# EAGLE design ESP32 AC dimmer 10ch r1 (EAGLE 9.0.0)
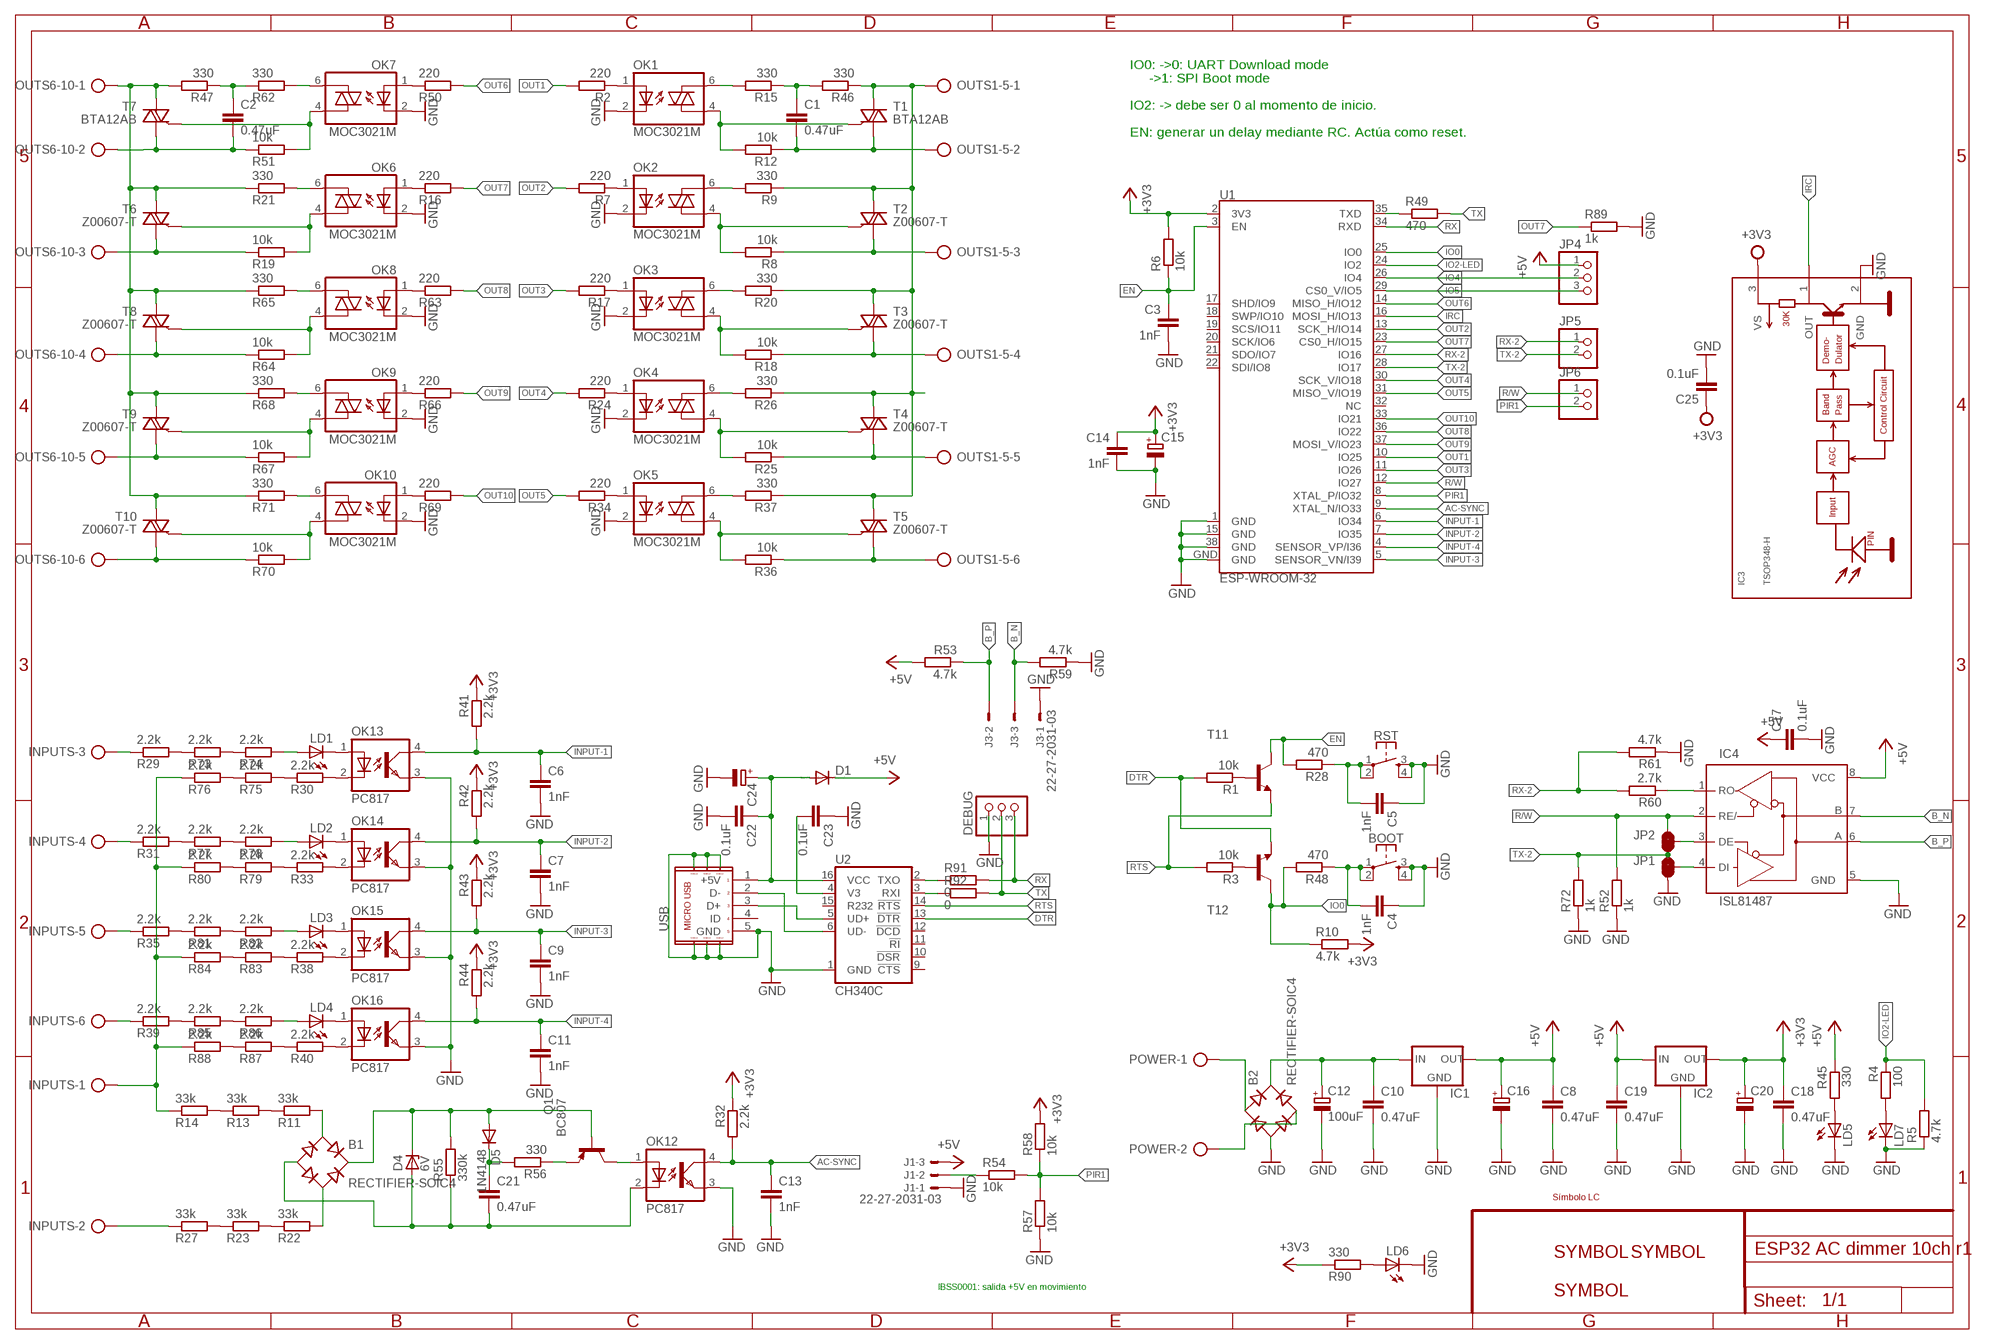
[diagram p0: schematic, sheet 1]

## Parts
B1  RECTIFIER-SOIC4  [SOIC4]
B2  RECTIFIER-SOIC4  [SOIC4]
BOOT  MOMENTARY-SWITCH-SPST-2-SMD-4.6X2.8MM  [TACTILE_SWITCH_SMD_4.6X2.8MM]
C1  0.47uF  C-EU075-042X103  [C075-042X103]
C2  0.47uF  C-EU075-042X103  [C075-042X103]
C3  1nF  C-EUC0603  [C0603]
C4  1nF  C-EUC0603  [C0603]
C5  1nF  C-EUC0603  [C0603]
C6  1nF  C-EUC0603  [C0603]
C7  1nF  C-EUC0603  [C0603]
C8  0.47uF  C-EUC0805  [C0805]
C9  1nF  C-EUC0603  [C0603]
C10  0.47uF  C-EUC0805  [C0805]
C11  1nF  C-EUC0603  [C0603]
C12  100uF  CPOL-EUE3.5-8  [E3,5-8]
C13  1nF  C-EUC0603  [C0603]
C14  1nF  C-EUC0805  [C0805]
C15  CPOL-EUSMCA  [SMC_A]
C16  CPOL-EUSMCA  [SMC_A]
C17  0.1uF  RCL_C-EUC0603  [RCL_C0603]
C18  0.47uF  C-EUC0805  [C0805]
C19  0.47uF  C-EUC0805  [C0805]
C20  CPOL-EUSMCA  [SMC_A]
C21  0.47uF  C-EUC0805  [C0805]
C22  0.1uF  C-EUC0603  [C0603]
C23  0.1uF  C-EUC0603  [C0603]
C24  CPOL-EUSMCA  [SMC_A]
C25  0.1uF  C-EUC0603  [C0603]
D1  DIODE-SOD323-R  [SOD323-R]
D4  6V  ZENER-DIODESOD80C  [SOD80C]
D5  1N4148  DIODE-MINIMELF  [MINIMELF]
DEBUG  PINHD-1X3  [1X03]
IC1  LM1117  [SOT223]
IC2  LM1117  [SOT223]
IC3  TSOP348-H  [TSOP348H]
IC4  ISL81487  MAXIM_MAX3468CSA  [MAXIM_SO08]
INPUTS  AK500/6  [AK500/6]
J1  22-27-2031-03  [6410-03]
J3  22-27-2031-03  [6410-03]
JP1  JUMPER-SMT_3_1-NC_TRACE_SILK  [SMT-JUMPER_3_1-NC_TRACE_SILK]
JP2  JUMPER-SMT_3_1-NC_TRACE_SILK  [SMT-JUMPER_3_1-NC_TRACE_SILK]
JP4  PINHD-1X3  [1X03]
JP5  PINHD-1X2  [1X02]
JP6  PINHD-1X2  [1X02]
LD1  LEDCHIPLED_0805  [CHIPLED_0805]
LD2  LEDCHIPLED_0805  [CHIPLED_0805]
LD3  LEDCHIPLED_0805  [CHIPLED_0805]
LD4  LEDCHIPLED_0805  [CHIPLED_0805]
LD5  LEDCHIPLED_0805  [CHIPLED_0805]
LD6  LEDCHIPLED_0805  [CHIPLED_0805]
LD7  LEDCHIPLED_0805  [CHIPLED_0805]
OK1  MOC3021M  [DIL06]
OK2  MOC3021M  [DIL06]
OK3  MOC3021M  [DIL06]
OK4  MOC3021M  [DIL06]
OK5  MOC3021M  [DIL06]
OK6  MOC3021M  [DIL06]
OK7  MOC3021M  [DIL06]
OK8  MOC3021M  [DIL06]
OK9  MOC3021M  [DIL06]
OK10  MOC3021M  [DIL06]
OK12  PC817  [DIL04]
OK13  PC817  [DIL04]
OK14  PC817  [DIL04]
OK15  PC817  [DIL04]
OK16  PC817  [DIL04]
OUTS1-5  AK500/6  [AK500/6]
OUTS6-10  AK500/6  [AK500/6]
POWER  AK500/2  [AK500/2]
Q1  BC807  BC807-25-PNP-SOT23-BEC  [SOT23-BEC]
R1  10k  R-EU_R0603  [R0603]
R2  220  R-EU_R0603  [R0603]
R3  10k  R-EU_R0603  [R0603]
R4  100  R-EU_R0603  [R0603]
R5  4.7k  R-EU_R0603  [R0603]
R6  10k  R-EU_R0603  [R0603]
R7  220  R-EU_R0603  [R0603]
R8  10k  R-EU_0204/5  [0204/5]
R9  330  R-EU_0204/5  [0204/5]
R10  4.7k  R-EU_R0603  [R0603]
R11  33k  R-EU_R0805  [R0805]
R12  10k  R-EU_0204/5  [0204/5]
R13  33k  R-EU_R0805  [R0805]
R14  33k  R-EU_R0805  [R0805]
R15  330  R-EU_0204/5  [0204/5]
R16  220  R-EU_R0603  [R0603]
R17  220  R-EU_R0603  [R0603]
R18  10k  R-EU_0204/5  [0204/5]
R19  10k  R-EU_0204/5  [0204/5]
R20  330  R-EU_0204/5  [0204/5]
R21  330  R-EU_0204/5  [0204/5]
R22  33k  R-EU_R0805  [R0805]
R23  33k  R-EU_R0805  [R0805]
R24  220  R-EU_R0603  [R0603]
R25  10k  R-EU_0204/5  [0204/5]
R26  330  R-EU_0204/5  [0204/5]
R27  33k  R-EU_R0805  [R0805]
R28  470  R-EU_R0603  [R0603]
R29  2.2k  R-EU_R0805  [R0805]
R30  2.2k  R-EU_R0805  [R0805]
R31  2.2k  R-EU_R0805  [R0805]
R32  2.2k  R-EU_R0603  [R0603]
R33  2.2k  R-EU_R0805  [R0805]
R34  220  R-EU_R0603  [R0603]
R35  2.2k  R-EU_R0805  [R0805]
R36  10k  R-EU_0204/5  [0204/5]
R37  330  R-EU_0204/5  [0204/5]
R38  2.2k  R-EU_R0805  [R0805]
R39  2.2k  R-EU_R0805  [R0805]
R40  2.2k  R-EU_R0805  [R0805]
R41  2.2k  R-EU_R0603  [R0603]
R42  2.2k  R-EU_R0603  [R0603]
R43  2.2k  R-EU_R0603  [R0603]
R44  2.2k  R-EU_R0603  [R0603]
R45  330  R-EU_R0603  [R0603]
R46  330  R-EU_0204/7  [0204/7]
R47  330  R-EU_0204/7  [0204/7]
R48  470  R-EU_R0603  [R0603]
R49  470  R-EU_R0603  [R0603]
R50  220  R-EU_R0603  [R0603]
R51  10k  R-EU_0204/5  [0204/5]
R52  1k  R-EU_R0603  [R0603]
R53  4.7k  R-EU_R0603  [R0603]
R54  10k  R-EU_R0603  [R0603]
R55  330k  R-EU_R0805  [R0805]
R56  330  R-EU_R0805  [R0805]
R57  10k  R-EU_R0603  [R0603]
R58  10k  R-EU_R0603  [R0603]
R59  4.7k  R-EU_R0603  [R0603]
R60  2.7k  R-EU_R0603  [R0603]
R61  4.7k  R-EU_R0603  [R0603]
R62  330  R-EU_0204/5  [0204/5]
R63  220  R-EU_R0603  [R0603]
R64  10k  R-EU_0204/5  [0204/5]
R65  330  R-EU_0204/5  [0204/5]
R66  220  R-EU_R0603  [R0603]
R67  10k  R-EU_0204/5  [0204/5]
R68  330  R-EU_0204/5  [0204/5]
R69  220  R-EU_R0603  [R0603]
R70  10k  R-EU_0204/5  [0204/5]
R71  330  R-EU_0204/5  [0204/5]
R72  1k  R-EU_R0603  [R0603]
R73  2.2k  R-EU_R0805  [R0805]
R74  2.2k  R-EU_R0805  [R0805]
R75  2.2k  R-EU_R0805  [R0805]
R76  2.2k  R-EU_R0805  [R0805]
R77  2.2k  R-EU_R0805  [R0805]
R78  2.2k  R-EU_R0805  [R0805]
R79  2.2k  R-EU_R0805  [R0805]
R80  2.2k  R-EU_R0805  [R0805]
R81  2.2k  R-EU_R0805  [R0805]
R82  2.2k  R-EU_R0805  [R0805]
R83  2.2k  R-EU_R0805  [R0805]
R84  2.2k  R-EU_R0805  [R0805]
R85  2.2k  R-EU_R0805  [R0805]
R86  2.2k  R-EU_R0805  [R0805]
R87  2.2k  R-EU_R0805  [R0805]
R88  2.2k  R-EU_R0805  [R0805]
R89  1k  R-EU_R0603  [R0603]
R90  330  R-EU_R0603  [R0603]
R91  0  R-EU_R0603  [R0603]
R92  0  R-EU_R0603  [R0603]
RST  MOMENTARY-SWITCH-SPST-2-SMD-4.6X2.8MM  [TACTILE_SWITCH_SMD_4.6X2.8MM]
SYM1  LC-3.81  [LC_3.81MM]
T1  BTA12AB  [TO220DS]
T2  Z00607-T  [TO92-A1GA2]
T3  Z00607-T  [TO92-A1GA2]
T4  Z00607-T  [TO92-A1GA2]
T5  Z00607-T  [TO92-A1GA2]
T6  Z00607-T  [TO92-A1GA2]
T7  BTA12AB  [TO220DS]
T8  Z00607-T  [TO92-A1GA2]
T9  Z00607-T  [TO92-A1GA2]
T10  Z00607-T  [TO92-A1GA2]
T11  BC817-16-NPN-SOT23-BEC  [SOT23-BEC]
T12  BC817-16-NPN-SOT23-BEC  [SOT23-BEC]
U1  ESP-WROOM-32  [ESP-WROOM-32]
U2  CH340C  [SO016]
U$1  SYMBOLS  [WIFI_SYM]
U$2  SYMBOLS  [WIFI_SYM]
U$3  SYMBOLS-1  [WIFI-SYM2]
USB  MICROUSB-LP  [MICROUSB-4PIN-LONGPIN]

## Nets
+3V3: C14.1 C15.+ C18.1 C20.+ C25.1 IC2.2(OUT) IC3.3(VS) R6.2 R10.2 R32.1 R41.1 R42.1 R43.1 R44.1 R58.2 R90.1 U1.2(3V3)
+5V: C8.1 C16.+ C17.1 C19.1 D1.C IC1.2(OUT) IC2.3(IN) IC4.8(VCC) J1.3 JP4.1 R45.1 R53.2 ; supply symbol labelled SUPPLY1_+5V
AC-SYNC: C13.1 OK12.4(COL) R32.2 U1.9(XTAL_N/IO33)
B_N: IC4.7(B) J3.3 R59.2
B_P: IC4.6(A) J3.2 R53.1
DTR: R1.2 T12.E U2.13(!DTR)
EN: C3.1 R6.1 R28.2 T11.C U1.3(EN)
FASE: OUTS6-10.1 R21.1 R47.2 R65.1 R68.1 R71.1 T6.A2 T7.A2 T8.A2 T9.A2 T10.A2
FASE1: OUTS1-5.1 R9.1 R20.1 R26.1 R37.1 R46.1 T1.A2 T2.A2 T3.A2 T4.A2 T5.A2
GND: B2.- BOOT.3 BOOT.4 C3.2 C4.1 C5.1 C6.2 C7.2 C8.2 C9.2 C10.2 C11.2 C12.- C13.2 C14.2 C15.- C16.- C17.2 C18.2 C19.2 C20.- C22.2 C23.1 C24.- C25.2 DEBUG.1 IC1.1(GND) IC2.1(GND) IC3.2(GND) IC4.5(GND) J1.1 J3.1 JP1.3 LD5.C LD6.C LD7.C OK1.2(C) OK2.2(C) OK3.2(C) OK4.2(C) OK5.2(C) OK6.2(C) OK7.2(C) OK8.2(C) OK9.2(C) OK10.2(C) OK12.3(EMIT) OK13.3(EMIT) OK14.3(EMIT) OK15.3(EMIT) OK16.3(EMIT) R5.1 R52.1 R57.1 R59.1 R61.1 R72.1 R89.2 RST.3 RST.4 U1.1(GND) U1.15(GND) U1.38(GND) U1.GND U2.1(GND) USB.5(GND) USB.P1 USB.P2 USB.P3 USB.P4 USB.P5 USB.P6 ; supply symbol labelled SUPPLY1_GND
INPUT-1: C6.1 OK13.4(COL) R41.2 U1.6(IO34)
INPUT-2: C7.1 OK14.4(COL) R42.2 U1.7(IO35)
INPUT-3: C9.1 OK15.4(COL) R43.2 U1.5(SENSOR_VN/I39)
INPUT-4: C11.1 OK16.4(COL) R44.2 U1.4(SENSOR_VP/I36)
IO0: R10.1 R48.2 T12.C U1.25(IO0)
IO2-LED: R4.1 R5.2 U1.24(IO2)
IO4: JP4.2 U1.26(IO4)
IO5: JP4.3 U1.29(CS0_V/IO5)
IRC: IC3.1(OUT) U1.16(MOSI_H/IO13)
N$1: OK7.1(A) R50.1
N$2: OK8.1(A) R63.1
N$3: OK9.1(A) R66.1
N$4: OK10.1(A) R69.1
N$5: OK1.4(A1) R12.2 T1.G
N$6: OK1.6(A2) R15.2
N$7: R1.1 T11.B
N$8: R3.1 T12.B
N$9: R49.1 U1.35(TXD)
N$10: C22.1 C24.+ D1.A U2.16(VCC) USB.1(+5V)
N$11: U2.6(UD-) USB.2(D-)
N$12: U2.5(UD+) USB.3(D+)
N$13: OUTS1-5.6 R36.1 T5.A1
N$14: OK2.4(A1) R8.2 T2.G
N$15: OK2.6(A2) R9.2
N$16: OUTS6-10.3 R19.1 T6.A1
N$17: C2.2 OUTS6-10.2 R51.1 T7.A1
N$18: OK6.4(A1) R19.2 T6.G
N$19: OK6.6(A2) R21.2
N$21: OK3.4(A1) R18.2 T3.G
N$22: OUTS6-10.4 R64.1 T8.A1
N$23: OK3.6(A2) R20.2
N$24: OUTS6-10.5 R67.1 T9.A1
N$25: OUTS6-10.6 R70.1 T10.A1
N$26: B2.+ C10.1 C12.+ IC1.3(IN)
N$27: LD6.A R90.2
N$28: LD7.A R4.2
N$29: OK7.4(A1) R51.2 T7.G
N$30: OK7.6(A2) R62.2
N$31: OK4.4(A1) R25.2 T4.G
N$32: OK4.6(A2) R26.2
N$33: OK1.1(A) R2.1
N$34: R11.1 R13.2
N$35: OK5.4(A1) R36.2 T5.G
N$36: OK5.6(A2) R37.2
N$37: R13.1 R14.2
N$38: R22.1 R23.2
N$39: R23.1 R27.2
N$40: BOOT.1 BOOT.2 C4.2 R48.1
N$41: B2.AC1 POWER.1
N$42: OK2.1(A) R7.1
N$43: OK3.1(A) R17.1
N$44: OK4.1(A) R24.1
N$45: OK8.4(A1) R64.2 T8.G
N$46: OK8.6(A2) R65.2
N$47: OK9.4(A1) R67.2 T9.G
N$48: B1.+ D4.C D5.A Q1.B R55.2
N$49: OK12.1(A) Q1.C
N$50: OK9.6(A2) R68.2
N$51: OK10.4(A1) R70.2 T10.G
N$52: OK10.6(A2) R71.2
N$53: OK5.1(A) R34.1
N$54: OK6.1(A) R16.1
N$55: B2.AC2 POWER.2
N$56: LD1.C OK13.1(A)
N$57: OK13.2(C) R30.2
N$58: Q1.E R56.1
N$59: LD1.A R74.2
N$60: C21.1 D5.C R56.2
N$61: OK14.2(C) R33.2
N$62: INPUTS.2 R27.1
N$63: B1.AC2 R22.2
N$64: LD2.C OK14.1(A)
N$65: B1.- C21.2 D4.A OK12.2(C) R55.1
N$66: OK15.2(C) R38.2
N$67: LD2.A R78.2
N$68: OK16.2(C) R40.2
N$69: INPUTS.3 R29.1
N$70: INPUTS.4 R31.1
N$71: INPUTS.5 R35.1
N$72: INPUTS.1 R14.1 R76.1 R80.1 R84.1 R88.1
N$73: INPUTS.6 R39.1
N$74: R91.1 U2.2(TXO)
N$75: LD3.C OK15.1(A)
N$76: LD3.A R82.2
N$77: LD4.C OK16.1(A)
N$78: LD4.A R86.2
N$79: LD5.A R45.2
N$80: C1.1 R15.1 R46.2
N$81: C2.1 R47.1 R62.1
N$82: C5.2 R28.1 RST.1 RST.2
N$83: IC4.1(RO) R60.1
N$84: B1.AC1 R11.2
N$85: IC4.4(DI) JP1.2
N$86: IC4.3(DE) JP2.2
N$87: J1.2 R54.1
N$88: R92.1 U2.3(RXI)
N$89: C23.2 U2.4(V3)
N$90: R29.2 R73.1
N$91: R73.2 R74.1
N$92: R30.1 R75.2
N$93: R75.1 R76.2
N$94: R31.2 R77.1
N$95: R77.2 R78.1
N$96: R33.1 R79.2
N$97: R79.1 R80.2
N$98: R35.2 R81.1
N$99: R81.2 R82.1
N$100: R38.1 R83.2
N$101: R83.1 R84.2
N$102: R39.2 R85.1
N$103: R85.2 R86.1
N$104: R40.1 R87.2
N$105: R87.1 R88.2
N$108: C1.2 OUTS1-5.2 R12.1 T1.A1
N$109: OUTS1-5.3 R8.1 T2.A1
N$1010: OUTS1-5.4 R18.1 T3.A1
N$1015: OUTS1-5.5 R25.1 T4.A1
OUT1: R2.2 U1.10(IO25)
OUT2: R7.2 U1.13(SCK_H/IO14)
OUT3: R17.2 U1.11(IO26)
OUT4: R24.2 U1.30(SCK_V/IO18)
OUT5: R34.2 U1.31(MISO_V/IO19)
OUT6: R50.2 U1.14(MISO_H/IO12)
OUT7: R16.2 R89.1 U1.23(CS0_H/IO15)
OUT8: R63.2 U1.36(IO22)
OUT9: R66.2 U1.37(MOSI_V/IO23)
OUT10: R69.2 U1.33(IO21)
PIR1: JP6.2 R54.2 R57.2 R58.1 U1.8(XTAL_P/IO32)
R/W: IC4.2(RE/) JP2.1 JP6.1 R52.2 U1.12(IO27)
RTS: R3.2 T11.E U2.14(!RTS)
RX: DEBUG.3 R91.2 U1.34(RXD)
RX-2: JP5.1 R60.2 R61.2 U1.27(IO16)
TX: DEBUG.2 R49.2 R92.2
TX-2: JP1.1 JP2.3 JP5.2 R72.2 U1.28(IO17)
Unconnected: U1.17(SHD/IO9) U1.18(SWP/IO10) U1.19(SCS/IO11) U1.20(SCK/IO6) U1.21(SDO/IO7) U1.22(SDI/IO8) U1.32(NC) U2.9(!CTS) U2.10(!DSR) U2.11(!RI) U2.12(!DCD) U2.15(R232) USB.4(ID)

## Notes on the sheet
- IO0: ->0: UART Download mode
       ->1: SPI Boot mode
  
  IO2: -> debe ser 0 al momento de inicio.
  
  EN: generar un delay mediante RC. Actúa como reset.
- IBSS0001: salida +5V en movimiento

## Library data of the parts
B1 B2 = rectifier:RECTIFIER-: Rectifier
BOOT RST = SparkFun-Switches:MOMENTARY-SWITCH-SPST-2: Momentary Switch (Pushbutton) - SPST - Two Circuits Normally-open (NO) SPST momentary switches (buttons, pushbuttons). Schematic symbol includes two switch circuits. Variants SMD-4.6MMX2.8MM - 4.60mm x 2.80mm Tactile Momentary Button Switch - Used on SparkFun SAMD21 Mini Breakout <https://www.sparkfun.com/products/13664> SMD-5.2MM - Mini Pushbutton Switch - SMD <https://www.sparkfun.com/products/8720> - Used on Arduino Pro Mini <https://www.sparkfun.com/products/11114>; PROD_ID: SWCH-13065
C1-C11 C13 C14 C18 C19 C21-C23 C25 = rcl:C-EU: CAPACITOR, European symbol
C12 = rcl:CPOL-EU: POLARIZED CAPACITOR, European symbol
C15 C16 C20 C24 = rcl:CPOL-EU: POLARIZED CAPACITOR, European symbol; SPICEPREFIX: C
C17 = IO r2.test:RCL_C-EU: CAPACITOR, European symbol
D1 D5 = diode:DIODE-: DIODE
D4 = diode:ZENER-DIODE: Z-Diode
DEBUG JP4 = -redpic-connector:PINHD-1X3: Pin Header 3
IC1 IC2 = v-reg-2:LM1117
IC3 = vishay-1:TSOP348*: IR Receiver Modules for Remote Control Systems http://www.vishay.com/ir-receiver-modules/
IC4 = IO r2.test:MAXIM_MAX34*: +5V, Fail-Safe, 40Mbps, Profibus RS-485/RS-422 Transceivers Source: MAX3465-MAX3469.pdf
INPUTS OUTS1-5 OUTS6-10 = con-ptr500:AK500/6: CONNECTOR; OC_FARNELL: unknown; OC_NEWARK: unknown
J1 J3 = con-molex:22-?-03: CONNECTOR wire to board 2.54 mm (.1 inch) pitch header
JP1 JP2 = SparkFun-Jumpers:JUMPER-SMT_3_1-NC_TRACE: Normally closed trace jumper (1 of 2 connections) This jumper has a trace between two pads so it's normally closed (NC). The other connection is normally open (NO). Use a razor knife to open the connection. For best results follow the IPC guidelines for cutting traces: Cutout at least 0.063 mm (0.005 in). Remove all loose material to clean up the cut area. Seal the cut with an approved epoxy. Reapply solder to reclose the connection, or to close the NO connection.
JP5 JP6 = -redpic-connector:PINHD-1X2: Pin Header 2
LD1-LD4 = led:LED: LED OSRAM: - CHIPLED LG R971, LG N971, LY N971, LG Q971, LY Q971, LO R971, LY R971 LH N974, LH R974 LS Q976, LO Q976, LY Q976 LO Q996 - Hyper CHIPLED LW Q18S LB Q993, LB Q99A, LB R99A - SideLED LS A670, LO A670, LY A670, LG A670, LP A670 LB A673, LV A673, LT A673, LW A673 LH A674 LY A675 LS A676, LA A676, LO A676, LY A676, LW A676 LS A679, LY A679, LG A679 - Hyper Micro SIDELED® LS Y876, LA Y876, LO Y876, LY Y876 LT Y87S - SmartLED LW L88C, LW L88S LB L89C, LB L89S, LG L890 LS L89K, LO L89K, LY L89K LS L896, LA L896, LO L896, LY L896 - TOPLED LS T670, LO T670, LY T670, LG T670, LP T670 LSG T670, LSP T670, LSY T670, LOP T670, LYG T670 LG T671, LOG T671, LSG T671 LB T673, LV T673, LT T673, LW T673 LH T674 LS T676, LA T676, LO T676, LY T676, LB T676, LH T676, LSB T676, LW T676 LB T67C, LV T67C, LT T67C, LS T67K, LO T67K, LY T67K, LW E67C LS E67B, LA E67B, LO E67B, LY E67B, LB E67C, LV E67C, LT E67C LW T67C LS T679, LY T679, LG T679 LS T770, LO T770, LY T770, LG T770, LP T770 LB T773, LV T773, LT T773, LW T773 LH T774 LS E675, LA E675, LY E675, LS T675 LS T776, LA T776, LO T776, LY T776, LB T776 LHGB T686 LT T68C, LB T68C - Hyper Mini TOPLED® LB M676 - Mini TOPLED Santana® LG M470 LS M47K, LO M47K, LY M47K Source: http://www.osram.convergy.de LUXEON: - LUMILED® LXK2-PW12-R00, LXK2-PW12-S00, LXK2-PW14-U00, LXK2-PW14-V00 LXK2-PM12-R00, LXK2-PM12-S00, LXK2-PM14-U00 LXK2-PE12-Q00, LXK2-PE12-R00, LXK2-PE12-S00, LXK2-PE14-T00, LXK2-PE14-U00 LXK2-PB12-K00, LXK2-PB12-L00, LXK2-PB12-M00, LXK2-PB14-N00, LXK2-PB14-P00, LXK2-PB14-Q00 LXK2-PR12-L00, LXK2-PR12-M00, LXK2-PR14-Q00, LXK2-PR14-R00 LXK2-PD12-Q00, LXK2-PD12-R00, LXK2-PD12-S00 LXK2-PH12-R00, LXK2-PH12-S00 LXK2-PL12-P00, LXK2-PL12-Q00, LXK2-PL12-R00 Source: www.luxeon.com KINGBRIGHT: KA-3528ASYC Source: www.kingbright.com
LD5-LD7 = led:LED: LED OSRAM: - CHIPLED LG R971, LG N971, LY N971, LG Q971, LY Q971, LO R971, LY R971 LH N974, LH R974 LS Q976, LO Q976, LY Q976 LO Q996 - Hyper CHIPLED LW Q18S LB Q993, LB Q99A, LB R99A - SideLED LS A670, LO A670, LY A670, LG A670, LP A670 LB A673, LV A673, LT A673, LW A673 LH A674 LY A675 LS A676, LA A676, LO A676, LY A676, LW A676 LS A679, LY A679, LG A679 - Hyper Micro SIDELED® LS Y876, LA Y876, LO Y876, LY Y876 LT Y87S - SmartLED LW L88C, LW L88S LB L89C, LB L89S, LG L890 LS L89K, LO L89K, LY L89K LS L896, LA L896, LO L896, LY L896 - TOPLED LS T670, LO T670, LY T670, LG T670, LP T670 LSG T670, LSP T670, LSY T670, LOP T670, LYG T670 LG T671, LOG T671, LSG T671 LB T673, LV T673, LT T673, LW T673 LH T674 LS T676, LA T676, LO T676, LY T676, LB T676, LH T676, LSB T676, LW T676 LB T67C, LV T67C, LT T67C, LS T67K, LO T67K, LY T67K, LW E67C LS E67B, LA E67B, LO E67B, LY E67B, LB E67C, LV E67C, LT E67C LW T67C LS T679, LY T679, LG T679 LS T770, LO T770, LY T770, LG T770, LP T770 LB T773, LV T773, LT T773, LW T773 LH T774 LS E675, LA E675, LY E675, LS T675 LS T776, LA T776, LO T776, LY T776, LB T776 LHGB T686 LT T68C, LB T68C - Hyper Mini TOPLED® LB M676 - Mini TOPLED Santana® LG M470 LS M47K, LO M47K, LY M47K Source: http://www.osram.convergy.de LUXEON: - LUMILED® LXK2-PW12-R00, LXK2-PW12-S00, LXK2-PW14-U00, LXK2-PW14-V00 LXK2-PM12-R00, LXK2-PM12-S00, LXK2-PM14-U00 LXK2-PE12-Q00, LXK2-PE12-R00, LXK2-PE12-S00, LXK2-PE14-T00, LXK2-PE14-U00 LXK2-PB12-K00, LXK2-PB12-L00, LXK2-PB12-M00, LXK2-PB14-N00, LXK2-PB14-P00, LXK2-PB14-Q00 LXK2-PR12-L00, LXK2-PR12-M00, LXK2-PR14-Q00, LXK2-PR14-R00 LXK2-PD12-Q00, LXK2-PD12-R00, LXK2-PD12-S00 LXK2-PH12-R00, LXK2-PH12-S00 LXK2-PL12-P00, LXK2-PL12-Q00, LXK2-PL12-R00 Source: www.luxeon.com KINGBRIGHT: KA-3528ASYC Source: www.kingbright.com; SPICEPREFIX: L
OK1-OK10 = optocoupler-2:MOC30*M: RANDOM-PHASE OPTOISOLATORS TRIAC DRIVER OUTPUT Source: http://www.fairchildsemi.com MOC3020-M.pdf
OK12-OK16 = optocoupler:PC817: SHARP OPTO COUPLER
POWER = con-ptr500:AK500/2: CONNECTOR; OC_FARNELL: unknown; OC_NEWARK: unknown
Q1 = transistor:*-PNP-: PNP Transistror
R1-R3 R5-R44 R46-R89 R91 R92 = rcl:R-EU_: RESISTOR, European symbol
R4 R45 R90 = rcl:R-EU_: RESISTOR, European symbol; SPICEPREFIX: R
SYM1 = Luis:LC
T1 T7 = triac:BTA12
T2-T6 T8-T10 = Luis:Z00607: Standard 0.8 A Triacs Features On-state rms current = 0.8 A Repetitive peak off-state voltage = 600 V Gate triggering current = 5 mA The Z00607 is suitable for low power AC switching applications. Typical applications include home appliances (electrovalve, pump, door lock, small lamp control), fan speed controllers,... Thanks to the low gate triggering current these triacs can be driven directly by microcontrollers.
T11 T12 = transistor-neu-to92:*-NPN-: NPN Transistror
U1 = SparkFun-RF:ESP-WROOM-32; PROD_ID: IC-13849
U2 = SparkFun-IC-Comms:CH340C; PROD_ID: IC-14038
U$1-U$3 = Luis:SYMBOLS
USB = Luis:MICROUSB

## Net classes
0 default: width 0.254 mm, drill 0.25 mm, clearance 0.152 mm
1 power: width 0.254 mm, drill 0.25 mm, clearance 0.152 mm
2 power3v3: width 0.254 mm, drill 0.3 mm, clearance 0.203 mm
3 p12v: width 0.254 mm, drill 0.25 mm

## Board
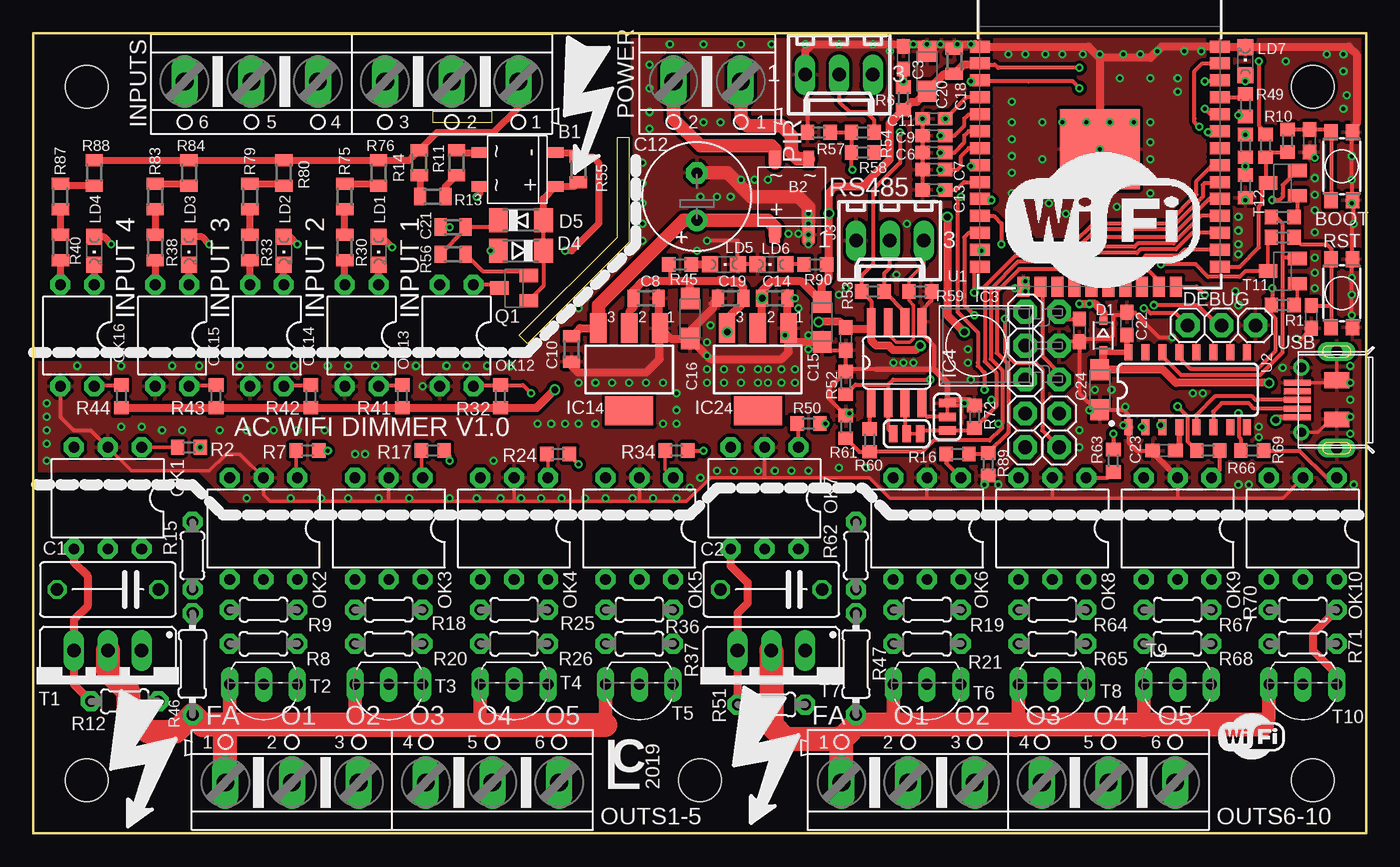
[diagram p1: board, top side]
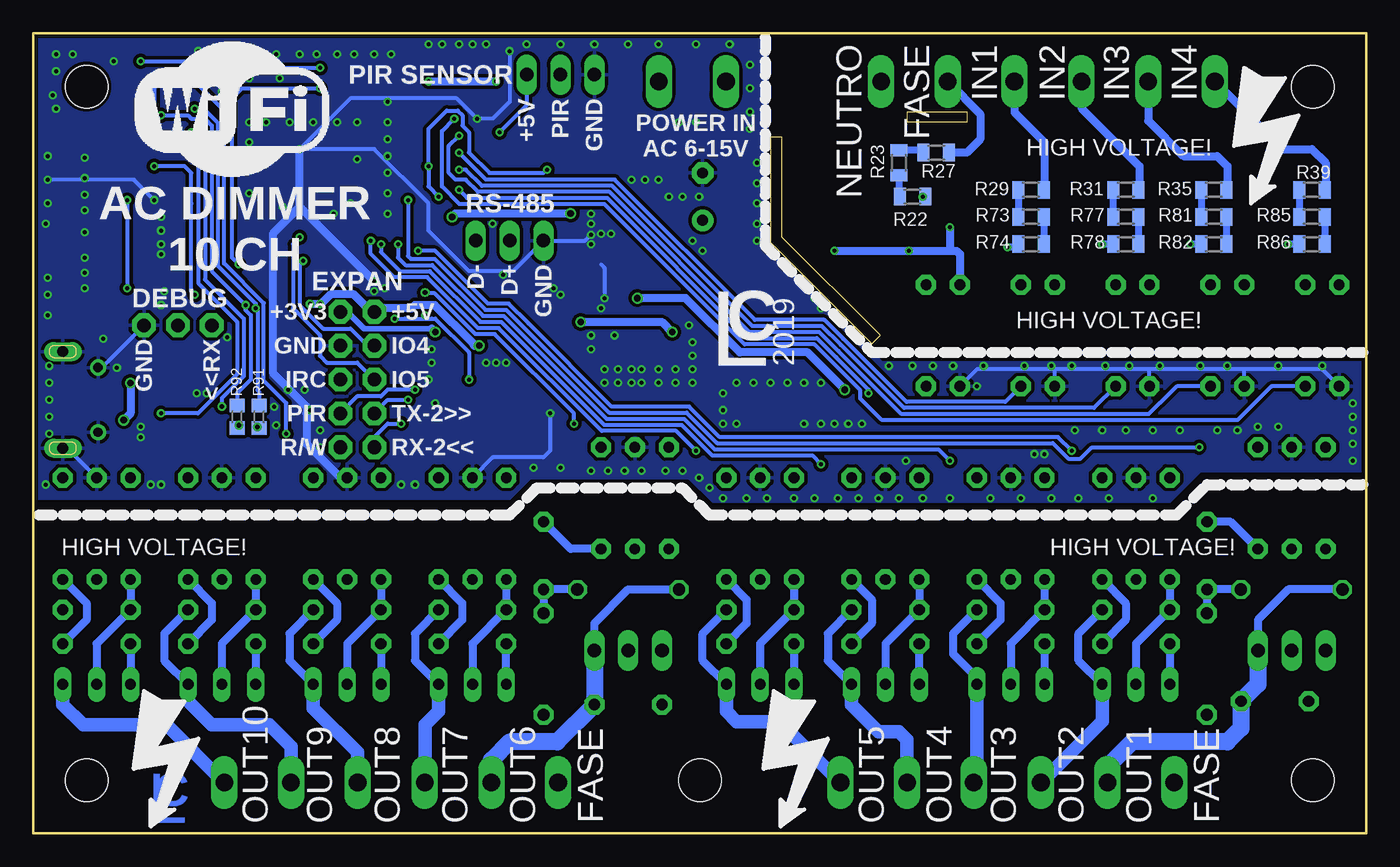
[diagram p2: board, bottom side, seen from below]

Size 100 x 60 mm. Coordinates in mm from the lower left corner, seen from the top.
Outline: 0,0 100,0 100,60 0,60 0,0
Outline: 36.45,37.34 43.81,44.7 43.81,49.28 43.81,52.2 44.07,52.2 44.7,52.2 44.7,44.32 37.08,36.7 36.45,37.34
Outline: 29.97,53.34 34.42,53.34 34.42,54.1 33.4,54.1 29.97,54.1 29.97,53.34
Copper layers (1*16): Top 0.035mm / dielectric 1.5mm / Bottom 0.035mm
Design rules "Fusion_eagle_rule_v1.1_4l *": minimum track width 6mil, minimum drill 0.3mm, track to track 6mil, track to pad 6mil, pad to pad 6mil, via to via 6mil, smd to smd 0mil, copper to edge 0.010159375mm, drill to drill 10mil, minimum pad ring 10mil, minimum via ring 6mil, stop-mask expansion 2mil, vias tented up to drill 100mil, thermal gap 10mil
Holes 3.2 mm at 4,56 96,56 96,4 4,4 50,4

### Footprints (pad centres in the part's own frame; a part is rotated, then mirrored left to right if it is on the bottom)
SOIC4 = smd 1.2 x 0.8: + 2.857,-1.27; - 2.857,1.27; AC1 -2.857,1.27; AC2 -2.857,-1.27
TACTILE_SWITCH_SMD_4.6X2.8MM = smd 1.2 x 1: 1 -2.558,-0.8; 2 2.558,-0.8; 3 2.558,0.8; 4 -2.558,0.8
C075-042X103 = drill 0.914 octagon: 1 -3.81,0; 2 3.81,0
C0603 = smd 1.1 x 1: 1 -0.85,0; 2 0.85,0
C0805 = smd 0.9 x 1.3: 1 -0.95,0; 2 0.95,0
E3,5-8 = drill 0.813 pad 1.6: + -1.778,0 | drill 0.813 pad 1.6 octagon: - 1.778,0
SMC_A = smd 1.6 x 1.4: + -1.5,0; - 1.5,0
RCL_C0603 = smd 1.1 x 1: 1 -0.85,0; 2 0.85,0
SOD323-R = smd 0.6 x 0.6: A 1.1,0; C -1.1,0
SOD80C = smd 1.4 x 1.8: A 1.7,0; C -1.7,0
MINIMELF = smd 1.4 x 1.8: A 1.7,0; C -1.7,0
1X03 = drill 1.016 pad 1.778 octagon: 1 -2.54,0; 2 0,0; 3 2.54,0
SOT223 = smd 1.219 x 2.235: 1 -2.311,-3.099; 2 0,-3.099; 3 2.311,-3.099 | smd 3.6 x 2.2: 4 0,3.099
TSOP348H = drill 1.016 pad 1.778 octagon: 1 -2.54,0; 2 0,0; 3 2.54,0
MAXIM_SO08 = smd 0.66 x 2.032: 1 -1.905,-3.073; 2 -0.635,-3.073; 3 0.635,-3.073; 4 1.905,-3.073; 5 1.905,3.073; 6 0.635,3.073; 7 -0.635,3.073; 8 -1.905,3.073
AK500/6 = drill 1.321 long: 1 -12.522,0; 2 -7.518,0; 3 -2.515,0; 4 2.515,0; 5 7.518,0; 6 12.522,0
6410-03 = drill 1.016 long: 1 2.54,0; 2 0,0; 3 -2.54,0
SMT-JUMPER_3_1-NC_TRACE_SILK = smd 0.635 x 1.27: 1 -1.016,0; 2 0,0; 3 1.016,0
1X02 = drill 1.016 pad 1.778 octagon: 1 -1.27,0; 2 1.27,0
CHIPLED_0805 = smd 1.2 x 1.2: A 0,-1.05; C 0,1.05
DIL06 = drill 0.8 pad 1.5 octagon: 1 -2.54,-3.81; 2 0,-3.81; 3 2.54,-3.81; 4 2.54,3.81; 5 0,3.81; 6 -2.54,3.81
DIL04 = drill 0.8 pad 1.5 octagon: 1 -1.27,-3.81; 2 1.27,-3.81; 3 1.27,3.81; 4 -1.27,3.81
AK500/2 = drill 1.321 long: 1 -2.515,0; 2 2.515,0
SOT23-BEC = smd 1 x 1.4: B -0.95,-1.1; C 0,1.1; E 0.95,-1.1
R0603 = smd 1 x 1.1: 1 -0.85,0; 2 0.85,0
0204/5 = drill 0.85 pad 1.5 octagon: 1 -2.54,0; 2 2.54,0
R0805 = smd 0.9 x 1.3: 1 -0.95,0; 2 0.95,0
0204/7 = drill 0.9 pad 1.5 octagon: 1 -3.81,0; 2 3.81,0
TO220DS = drill 1.016 long: A1 -2.54,-2.54; A2 0,-2.54; G 2.54,-2.54
TO92-A1GA2 = drill 0.813 long: A1 -2.54,0; A2 2.54,0; G 0,0
ESP-WROOM-32 = smd 0.9 x 1.5: 1 7.7,9; 2 6.43,9; 3 5.16,9; 4 3.89,9; 5 2.62,9; 6 1.35,9; 7 0.08,9; 8 -1.19,9; 9 -2.46,9; 10 -3.73,9; 11 -5,9; 12 -6.27,9; 13 -7.54,9; 14 -8.81,9; 25 -8.81,-9; 26 -7.54,-9; 27 -6.27,-9; 28 -5,-9; 29 -3.73,-9; 30 -2.46,-9; 31 -1.19,-9; 32 0.08,-9; 33 1.35,-9; 34 2.62,-9; 35 3.89,-9; 36 5.16,-9; 37 6.43,-9; 38 7.7,-9 | smd 1.5 x 0.9: 15 -10.3,5.715; 16 -10.3,4.445; 17 -10.3,3.175; 18 -10.3,1.905; 19 -10.3,0.635; 20 -10.3,-0.635; 21 -10.3,-1.905; 22 -10.3,-3.175; 23 -10.3,-4.445; 24 -10.3,-5.715 | smd 6 x 6: GND 0,0
SO016 = smd 0.6 x 1.2: 1 -4.445,-2.8; 2 -3.175,-2.8; 3 -1.905,-2.8; 4 -0.635,-2.8; 5 0.635,-2.8; 6 1.905,-2.8; 7 3.175,-2.8; 8 4.445,-2.8; 9 4.445,2.8; 10 3.175,2.8; 11 1.905,2.8; 12 0.635,2.8; 13 -0.635,2.8; 14 -1.905,2.8; 15 -3.175,2.8; 16 -4.445,2.8
MICROUSB-4PIN-LONGPIN = smd 2 x 0.45: 1 2.956,1.3; 2 2.956,0.65; 3 2.956,0; 4 2.956,-0.65; 5 2.956,-1.3 | drill 0.7: P1 2.65,2.425; P2 2.65,-2.425 | drill 0.8 pad 1.422 long: P3 0,3.625; P4 0,-3.625 | smd 1.9 x 1.175: P5 0,1.472; P6 0,-1.472

### Placement (x,y rotation side)
B1  36.32,49.78 0 top
B2  56.9,47.75 270 top
BOOT  98.17,50.04 270 top
C1  5.59,18.29 180 top
C2  55.37,18.29 180 top
C3  65.28,58.17 90 top
C4  95.76,51.94 90 top
C5  95.89,38.73 90 top
C6  67.56,51.05 180 top
C7  67.56,49.78 180 top
C8  45.97,40.13 0 top
C9  67.56,52.32 180 top
C10  40.39,36.32 270 top
C11  67.56,53.59 180 top
C12  49.78,47.75 90 top
C13  67.56,48.26 180 top
C14  55.63,40.13 0 top
C15  59.18,38.35 270 top
C16  49.28,38.61 270 top
C17  60.96,37.08 270 top
C18  69.09,57.91 90 top
C19  52.32,40.13 180 top
C20  67.06,57.15 90 top
C21  31.5,45.47 180 top
C22  82.04,38.23 90 top
C23  84.84,28.7 0 top
C24  80.01,33.27 270 top
C25  78.49,37.72 270 top
D1  80.26,37.34 270 top
D4  36.58,43.69 180 top
D5  36.58,45.97 0 top
DEBUG  89.15,38.1 180 top
IC1  44.7,34.8 180 top
IC2  54.36,34.8 180 top
IC3  76.96,36.58 90 top
IC4  64.77,35.31 0 top
INPUTS  23.88,56.39 180 top
J1  60.45,56.9 180 top
J3  64.26,44.45 180 top
JP1  68.58,31.24 90 top
JP2  65.53,29.97 0 top
JP4  74.42,36.58 270 top
JP5  74.42,30.23 90 top
JP6  76.96,30.23 90 top
LD1  25.91,43.69 180 top
LD2  18.8,43.69 180 top
LD3  11.68,43.69 180 top
LD4  4.57,43.69 180 top
LD5  51.82,42.67 270 top
LD6  55.37,42.67 90 top
LD7  90.93,57.91 0 top
OK1  5.59,25.15 180 top
OK2  17.27,22.86 180 top
OK3  26.67,22.86 180 top
OK4  36.07,22.86 180 top
OK5  45.47,22.86 180 top
OK6  67.06,22.86 180 top
OK7  54.86,25.15 180 top
OK8  76.45,22.86 180 top
OK9  85.85,22.86 180 top
OK10  95.25,22.86 180 top
OK12  31.75,37.34 180 top
OK13  24.64,37.34 180 top
OK14  17.53,37.34 180 top
OK15  10.41,37.34 180 top
OK16  3.3,37.34 180 top
OUTS1-5  26.92,3.81 0 top
OUTS6-10  73.15,3.81 0 top
POWER  50.55,56.39 180 top
Q1  36.07,40.89 90 top
R1  93.73,39.62 180 top
R2  11.68,28.96 0 top
R3  93.73,46.23 180 top
R4  90.93,51.56 90 top
R5  90.93,48.51 90 top
R6  65.28,55.12 270 top
R7  20.57,28.7 0 top
R8  17.27,16.76 180 top
R9  17.27,14.22 0 top
R10  92.46,51.56 90 top
R11  31.75,50.29 90 top
R12  6.86,9.91 180 top
R13  29.97,47.75 0 top
R14  28.96,50.29 270 top
R15  11.94,20.83 90 top
R16  69.34,28.45 0 top
R17  29.97,28.7 0 top
R18  26.67,16.76 180 top
R19  67.06,16.76 180 top
R20  26.67,14.22 0 top
R21  67.06,14.22 0 top
R22  34.04,47.75 0 bottom
R23  35.05,50.29 270 bottom
R24  39.37,28.45 0 top
R25  36.07,16.76 180 top
R26  36.07,14.22 0 top
R27  32.26,51.05 180 bottom
R28  93.73,44.7 180 top
R29  25.15,48.26 180 bottom
R30  23.37,43.94 270 top
R31  18.03,48.26 180 bottom
R32  35.05,32.77 90 top
R33  16.26,43.94 270 top
R34  48.26,28.7 0 top
R35  11.43,48.26 180 bottom
R36  45.47,16.76 180 top
R37  45.47,14.22 0 top
R38  9.14,43.94 270 top
R39  4.06,48.26 180 bottom
R40  2.03,43.94 270 top
R41  27.69,32.77 90 top
R42  20.83,32.77 90 top
R43  13.72,32.77 90 top
R44  6.6,32.77 90 top
R45  48.51,42.67 0 top
R46  11.94,12.7 90 top
R47  61.72,12.7 270 top
R48  94.11,51.94 270 top
R49  90.93,54.61 270 top
R50  58.17,30.73 0 top
R51  55.37,9.65 180 top
R52  60.96,33.78 270 top
R53  62.99,40.64 180 top
R54  62.23,52.58 180 top
R55  40.89,49.78 270 top
R56  31.5,43.43 180 top
R57  58.93,52.58 0 top
R58  62.23,51.05 0 top
R59  66.55,40.64 180 top
R60  62.74,29.46 270 top
R61  60.96,30.48 270 top
R62  61.72,20.83 90 top
R63  81.03,27.94 90 top
R64  76.45,16.76 180 top
R65  76.45,14.22 0 top
R66  88.14,28.7 180 top
R67  85.85,16.76 180 top
R68  85.85,14.22 0 top
R69  91.44,28.7 180 top
R70  95.25,16.76 180 top
R71  95.25,14.22 0 top
R72  70.61,31.24 270 top
R73  25.15,46.23 0 bottom
R74  25.15,44.2 180 bottom
R75  23.37,47.75 270 top
R76  25.91,49.53 270 top
R77  18.03,46.23 0 bottom
R78  18.03,44.2 180 bottom
R79  16.26,47.75 270 top
R80  18.8,49.53 270 top
R81  11.43,46.23 0 bottom
R82  11.43,44.2 180 bottom
R83  9.14,47.75 270 top
R84  11.68,49.53 270 top
R85  4.06,46.23 0 bottom
R86  4.06,44.2 180 bottom
R87  2.03,47.75 270 top
R88  4.57,49.53 270 top
R89  71.63,27.69 270 top
R90  58.67,42.67 180 top
R91  83.06,31.24 90 bottom
R92  84.71,31.24 90 bottom
RST  98.17,40.51 270 top
SYM1  91.44,0.76 0 bottom
T1  5.59,11.18 180 top
T2  17.27,11.18 180 top
T3  26.67,11.18 180 top
T4  36.07,11.18 180 top
T5  45.47,11.18 180 top
T6  67.06,11.18 180 top
T7  55.37,11.18 180 top
T8  76.45,11.18 180 top
T9  85.85,11.18 180 top
T10  95.25,11.18 180 top
T11  93.73,42.16 90 top
T12  93.73,48.77 90 top
U1  80.01,51.31 90 top
U2  86.61,33.27 0 top
U$1  80.41,45.99 0 top
U$2  84.94,54.31 0 bottom
U$3  88.9,5.33 0 top
USB  97.79,32.51 180 top

### Tracks (layer width: path | path; a pad name or v marks a point on that pad's centre or on a via)
+3V3  (via drill 0.3, 0.5)
  Top 0.305: v91.95,57.91 91.95,53.09 92.46,52.58 R10.2 | v78.49,57.4 72.39,57.4 72.14,57.66 70.93,57.66 | IC3.3 77.51,38.57 C25.1 | R90.1 59.69,42.67
  Top 0.61: IC2.2 54.68,38.22 C14.1 54.68,40.71 55.37,41.4 57.63,41.4 C15.+ 59.18,41.15 59.69,41.66 59.69,42.67 v59.69,46.48 59.69,48.01 60.2,48.51 62.23,48.51 64.26,50.55 64.26,51.05 | 70.93,57.66 U1.2 70.93,57.66 | 66.66,55.65 C20.+ | C20.+ 68.37,56.96 C18.1 69.78,57.66 70.93,57.66 | R44.1 R43.1 R42.1 R41.1 R32.1 37.76,31.92 v39.12,33.27 | 64.26,51.05 64.26,52.58 64.26,53.25 R6.2 65.87,54.86 66.29,54.86 67.06,55.63 C20.+ | R58.2 64.26,51.05 | v68.58,46.23 68.58,38.86 v69.85,37.59
  Bottom 0.305: v91.95,57.91 85.34,57.91 84.84,57.4 79.5,57.4 v78.49,57.4
  Bottom 0.406: IC3.3 76.45,39.12 75.18,37.85 70.1,37.85
  Bottom 0.61: v39.12,33.27 41.91,36.07 46.99,36.07 51.05,40.13 C14.1 | v59.69,46.48 68.33,46.48 v68.58,46.23 | v69.85,37.59 70.1,37.85
  other vias: 54.68,40.13
+5V  (via drill 0.3, 0.5)
  Top 0.305: IC4.8 62.87,39.92 R53.2 62.14,41.82 62.99,42.67 62.99,48.26 65.02,50.29 v65.02,52.58 | v52.07,37.59 52.05,37.62 IC2.3 | R45.1 47.75,42.58 47.75,41.4
  Top 0.61: IC1.2 44.7,39.12 45.02,39.44 C8.1 45.02,40.71 45.72,41.4 47.75,41.4 49.28,41.4 | IC2.3 52.05,38.58 53.27,39.81 C19.1 53.27,40.96 52.83,41.4 51.56,41.4 | 51.56,41.4 49.28,41.4 | C16.+ 49.28,41.4 | 51.47,41.49 51.56,41.4 | D1.C 80.26,39.12 79.68,39.7 v79.25,39.7 v78.49,39.7 | 62.87,37.85 62.87,36.96 63.25,36.58 64.2,36.58 64.53,36.25 66.19,36.25 66.52,36.58 v66.55,36.58 | 62.87,37.85 IC4.8 | 62.87,37.85 61.05,37.85 C17.1 60.54,38.35 v58.93,38.35
  Bottom 0.305: J1.3 62.99,54.61 v65.02,52.58
  Bottom 0.61: 66.83,36.58 66.8,36.58 | 66.8,36.58 v66.55,36.58 | v79.25,39.7 78.41,39.7 77.65,40.46 76.02,40.46 74.93,39.37 74.42,39.37 | 66.96,36.58 66.8,36.58 | 66.8,36.58 67.06,36.83 67.09,36.83 69.88,39.62 71.37,39.62 71.63,39.37 74.42,39.37 | JP4.1 74.42,39.37 | v58.93,38.35 52.83,38.35 v52.07,37.59
AC-SYNC  (via drill 0.3)
  Top 0.305: v68.07,48.26 C13.1 69.25,48.26 69.83,48.85 U1.9 | OK12.4 33.11,33.62 R32.2 36.74,33.62 v37.34,33.02
  Bottom 0.305: v37.34,33.02 37.34,33.27 39.78,35.71 39.79,35.71 41.21,37.13 46.44,37.13 56.96,47.65 67.46,47.65 v68.07,48.26
B_N
  Top 0.254: J3.3 66.8,42.67 65.7,41.57 R59.2 65.7,39.97 66.04,39.62 66.04,37.08 65.79,36.83 64.77,36.83 64.14,37.47 IC4.7
B_P
  Top 0.305: IC4.6 65.41,39.08 R53.1 63.84,42 64.26,42.42 J3.2
DTR  (via drill 0.3)
  Top 0.305: U2.13 85.98,35.69 86.82,34.85 91.86,34.85 93.22,36.21 93.22,38.61 92.88,38.95 R1.2 92.96,39.71 v92.96,40.89 | T12.E 93.73,48.62 93.73,48.01 93.73,47.75 93.47,47.5 v92.96,47.5
  Bottom 0.305: v92.96,47.5 v92.96,40.89
EN  (via drill 0.3)
  Top 0.254: R28.2 92.63,44.45 T11.C
  Top 0.305: T11.C 90.93,42.16 90.51,41.74 88.13,41.74 87.2,42.67 v84.58,42.67 | v78.49,55.88 77.98,56.39 74.68,56.39 71.09,56.39 U1.3
  Top 0.61: R6.1 v65.28,56.39 C3.1 | U1.3 70.44,56.47 v70.36,56.39
  Bottom 0.305: v84.58,42.67 85.09,43.18 85.09,55.12 84.33,55.88 v78.49,55.88
  Bottom 0.61: v70.36,56.39 v65.28,56.39
FASE
  Top 1.016: T10.A2 92.71,8.64 92.2,8.13 | T9.A2 83.31,8.13 | T8.A2 73.91,8.38 73.66,8.13 | T6.A2 64.52,8.38 64.26,8.13 | R47.2 61.72,8.13
  Top 1.8: OUTS6-10.1 60.63,6.86 | 60.63,6.86 60.63,7.04 60.96,7.37 61.72,8.13 64.26,8.13 73.66,8.13 83.31,8.13 92.2,8.13 | T7.A2 55.37,8.13 56.39,7.11 60.38,7.11 60.63,6.86
  Bottom 0.61: T6.A2 R21.1 | R65.1 T8.A2 | R68.1 T9.A2 | R71.1 T10.A2
FASE1
  Top 1.016: 42.93,8.13 42.93,9.65 T5.A2 | T4.A2 33.53,8.13 | T3.A2 24.13,8.13 | 14.48,8.13 14.73,8.38 T2.A2
  Top 1.8: 42.93,8.13 33.53,8.13 24.13,8.13 14.48,8.13 | 14.48,8.13 12.7,8.13 R46.1 10.67,7.62 8.64,7.62 7.11,9.14 7.11,10.67 5.59,12.19 T1.A2 | OUTS1-5.1 14.4,8.05 14.48,8.13
  Bottom 0.61: R9.1 T2.A2 | R20.1 T3.A2 | T4.A2 R26.1 | R37.1 T5.A2
GND  (via drill 0.3)
  Top 0.254: 26.67,24.89 17.78,24.89 17.27,25.4 OK2.2 15.49,28.45 14.48,28.45 13.21,27.18 7.37,27.18 OK1.2 | 26.67,24.89 36.07,24.89 | 36.07,24.89 45.47,24.89 | 45.47,24.89 49.02,24.89 50.8,26.67 54.86,26.67 | 54.86,26.67 62.74,26.67 64.26,25.15 67.06,25.15 | 67.06,25.15 76.45,25.15 | 76.45,25.15 85.85,25.15 | 85.85,25.15 93.73,25.15 OK10.2 | OK9.2 85.85,25.15 | OK8.2 76.45,25.15 | OK6.2 67.06,25.15 | OK7.2 54.86,26.67 | OK5.2 45.47,24.89 | OK4.2 36.07,24.89 | OK3.2 26.67,24.89 | USB.P4 USB.P6 | USB.5 97.11,33.81 | USB.P1 96.38,30.09 97.28,30.99
  Top 0.305: 60.96,34.8 R52.1 59.69,33.36 59.69,32.6 R61.1 61.13,31.5 v61.21,31.5 | 60.96,34.8 C17.2 59.8,36.23 C15.- | J1.1 58.08,56.73 R57.1 | R59.1 67.4,39.97 66.67,39.24 IC4.5 66.67,37.47 67.56,36.58 67.56,34.8 | 76.45,26.92 OK8.2 | LD7.C 91.39,58.96 91.44,59.01 | C23.1 82.8,28.7 82.17,29.34 U2.1 82.14,30.47 82.14,31.39 81.76,31.77 C24.- 79.78,31.77 79.76,31.75 78.49,33.02 C25.2 | v90.93,47.5 91.1,47.5 R5.1 | JP1.3 68.83,32.26 69,32.09 R72.1 | C13.2 C7.2 C6.2 C9.2 C11.2 | OK16.3 2.03,31.24 3.05,30.23 4.32,30.23 OK1.2 | C25.2 77.25,36.87 IC3.2 | 82.45,38.86 81.03,38.86 81.03,37.34 80.77,37.08 78.57,37.08 78.49,37 C25.2 | 63.25,34.8 60.96,34.8 | v57.15,40.13 C14.2 | 64.26,59.18 v64.26,58.67 | v50.55,44.45 52.83,44.45 52.83,42.71 LD5.C LD6.C | C22.2 82.59,39.08 84.45,37.21 v85.47,37.21 | 98.97,47.21 BOOT.3 98.97,48.98 v98.93,49.02 v98.93,50.8 98.93,52.56 BOOT.4 99.29,52.91 99.29,53.19 | 98.97,47.21 v98.93,47.24 | v94.74,37.08 95.12,37.08 96.01,37.97 95.92,37.88 C5.1 | RST.3 98.97,38.82 v98.93,38.86 v98.93,40.39 v98.93,41.66 98.93,43.03 RST.4 98.97,45.63 v99.06,45.72 99.06,47.12 98.97,47.21 | 97.11,33.81 97.62,33.81 USB.P6 | 97.28,30.99 97.33,31.04 USB.P5 | C4.1 96.14,50.71 v96.14,50.67 | v71.37,26.16 71.37,26.58 R89.2
  Top 0.406: C23.1 83.99,28.54 OK9.2 | 63.25,34.8 67.56,34.8 68.58,33.78 68.58,32.51 | 68.58,32.51 68.58,32.31 68.58,32.51 | 68.58,32.51 70.19,32.51 R72.1
  Top 0.61: C16.- 47.8,37.11 IC1.1 46.92,37.99 | C16.- 50.82,35.56 56.13,35.56 56.67,36.09 56.67,36.83 | 56.67,36.83 IC2.1 56.58,37.99 C14.2 | C15.- 59.16,36.83 56.67,36.83 | C8.2 46.92,37.99 | C19.2 50.98,39.74 50.98,39.37 49.28,37.67 C16.- | 46.92,37.99 46.99,37.92 46.99,35.56 45.97,34.54 40.89,34.54 40.39,35.05 C10.2 | J1.1 57.91,58.67 58.42,59.18 64.26,59.18 65.28,59.18 | R57.1 58.17,52.49 | 80.01,58.17 79.17,59.01 U1.1 70.93,58.93 70.68,59.18 69.09,59.18 | 80.01,58.17 U1.GND | 80.01,58.17 83.82,58.17 84.66,59.01 U1.38 91.44,59.01 98.7,59.01 99.29,58.42 99.29,53.19 | 65.28,59.18 66.8,59.18 | 66.8,59.18 69.09,59.18 | C18.2 69.09,59.18 | C20.- 67.06,58.93 66.8,59.18 | C3.2 65.28,59.18 | U1.15 74.3,41.27 v74.42,41.4 | C24.- 79.27,31.77 v79.25,31.75
  Top 1.016: C12.- 52.07,49.53 53.85,47.75 57.4,47.75 58.17,46.99 B2.- 58.17,44.45
  Bottom 0.305: OK16.3 3.3,34.8 9.14,34.8 | OK12.3 29.21,34.8 23.37,34.8 | 9.14,34.8 16.26,34.8 | 16.26,34.8 23.37,34.8 | OK13.3 23.37,34.8 | OK14.3 16.26,34.8 | OK15.3 9.14,34.8 | v90.93,47.5 92.46,49.02 v98.93,49.02 | DEBUG.1 94.63,35.16 | 95.25,26.86 OK10.2 97.47,28.89 USB.P3 | B2.- 58.61,44.45 J3.1 64.01,42.16 67.31,42.16 70.36,45.21 70.36,47.24 74.42,51.31 U1.GND 76.2,55.12 68.24,55.12 C11.2 65.53,53.59 64.26,54.86 v64.26,58.67 | v61.21,31.5 61.21,28.7 61.72,28.19 65.53,28.19 OK6.2 | 57.4,42.67 57.15,42.42 v57.15,40.13
  Bottom 0.61: v74.42,41.4 80.01,46.99 | 80.01,46.99 U1.GND | 80.01,46.99 82.04,44.96 82.04,38.99 82.04,34.54 79.5,32 79.5,31.5 | OK8.2 76.96,26.67 79.5,29.21 79.5,31.5 | v79.25,31.75 79.5,31.5
  other vias: 58.17,44.89 80.01,51.31 66.71,53.59 47.75,59.18 50.29,59.18 53.09,59.18 55.37,59.18 57.91,59.18 60.45,59.18 62.99,59.18 45.72,50.29 45.72,48.77 45.72,47.24 45.72,45.72 45.72,44.45 50.04,47.75 51.31,47.75 52.32,47.75 49.78,43.69 37.85,30.73 38.86,30.73 39.88,30.73 40.89,30.73 42.16,30.73 47.24,30.73 48.26,30.73 48.26,31.75 48.26,33.02 47.24,33.78 45.97,33.78 44.7,33.78 43.43,33.78 42.16,33.78 40.89,33.78 51.82,34.8 53.09,34.8 54.36,34.8 55.12,34.8 56.13,34.8 57.15,34.8 57.15,33.78 56.13,33.78 55.12,33.78 54.36,33.78 53.09,33.78 51.82,33.78 50.55,33.78 50.55,34.8 50.55,35.81 50.55,36.83 50.8,38.1 56.39,37.34 57.4,39.37 60.96,40.89 60.45,40.39 64.52,35.31 65.28,35.31 66.04,35.31 70.1,36.32 70.1,35.31 70.36,34.04 72.39,26.16 58.17,27.18 56.9,27.18 55.63,27.18 54.36,27.18 52.58,27.18 51.31,27.18 50.04,26.67 49.28,25.91 48.26,25.15 46.48,25.15 44.96,25.15 42.93,25.15 41.4,25.15 39.62,25.15 38.1,25.15 36.58,25.15 35.05,25.15 33.27,25.15 31.24,25.15 28.19,25.15 25.91,25.15 23.62,25.15 21.59,25.15 19.3,25.15 16,25.15 1.02,32.26 1.02,31.24 1.02,30.23 1.02,29.21 1.02,27.94 6.6,30.48 8.13,30.48 9.65,30.23 11.18,30.23 13.97,30.23 16,30.23 18.03,30.23 19.81,30.23 21.84,30.23 3.3,35.05 10.41,35.05 6.6,35.05 12.45,35.05 15.49,35.05 17.78,35.05 19.56,35.05 22.1,35.05 23.62,35.05 25.65,35.05 28.7,35.05 30.99,35.05 32.51,35.05 34.04,35.05 29.21,33.53 24.13,28.45 24.89,28.45 87,33.02 87.76,33.02 98.81,35.05 98.81,33.78 98.81,32.51 98.81,31.24 98.81,29.97 98.3,54.36 98.55,55.37 98.3,57.15 98.3,58.42 97.03,58.42 93.98,57.91 73.41,54.86 73.41,53.34 73.41,52.07 73.41,50.8 73.41,49.53 73.41,48.01 73.41,46.48 75.69,53.34 77.22,53.34 78.99,53.34 80.77,53.34 82.55,53.34 83.82,53.34 83.82,51.82 83.82,50.55 83.82,48.01 81.28,46.99 77.47,46.48 76.2,47.24 75.69,50.55 73.15,58.42 74.42,58.42 75.95,58.42 77.22,58.42 78.74,58.42 80.01,58.42 81.79,58.42 83.06,58.42 84.33,58.67 86.36,58.67 87.63,58.67 85.85,56.64 85.85,55.63 81.53,56.64 83.82,56.64 66.04,59.18 67.06,59.18 68.07,59.18 69.34,59.18 70.36,59.18 53.09,49.02 54.1,49.02 55.12,49.02 56.64,44.96 57.4,44.96 58.17,46.48 58.17,45.72 58.17,44.2 58.17,37.34 58.17,36.32 62.48,27.43 60.45,27.43 69.85,32.26 78.49,30.23 78.49,28.96 91.95,30.48 91.95,29.72 90.42,26.16 91.19,26.16 99.06,26.16 90.42,46.23 90.42,45.21 90.42,44.2 90.42,43.43 90.42,39.62 90.17,40.64 46.23,57.66 46.23,55.88 46.23,54.1 46.23,52.83 50.29,53.34 51.56,53.34 64.77,41.91 65.53,45.72 41.4,40.13 40.89,39.37 35.81,35.05 34.54,27.94 74.42,40.64 73.66,40.89 81.92,32 81.79,30.61 79.63,33.27 80.9,33.27 96.14,49.15 96.14,47.88 96.14,46.74 96.14,45.09 96.14,43.18 96.14,42.04 96.14,40.89 93.73,34.92
  pour Top (isolate 0.254): 100.08,25.15 64.26,25.15 62.74,26.67 50.8,26.67 49.02,24.89 14.73,24.89 12.45,27.18 0,27.18 0,35.31 36.32,35.31 44.96,43.94 44.96,60.2 100.08,60.2
  pour Bottom (isolate 0.254): 100.08,25.15 64.26,25.15 62.74,26.67 50.8,26.67 49.02,24.89 14.73,24.89 12.45,27.18 0,27.18 0,35.31 36.32,35.31 44.96,43.94 44.96,60.2 100.08,60.2
INPUT-1  (via drill 0.3)
  Top 0.305: U1.6 70.18,52.66 69.85,52.32 69.85,51.82 69.09,51.05 C6.1 v68.07,51.05 | OK13.4 26,33.62 R41.2
  Bottom 0.305: OK13.4 27.08,32.36 34.48,32.36 39.21,37.08 39.22,37.08 40.65,38.51 45.87,38.51 56.39,49.02 66.04,49.02 v68.07,51.05
INPUT-2  (via drill 0.3)
  Top 0.305: U1.7 70.18,51.39 69.6,50.8 69.6,50.04 69.34,49.78 C7.1 v68.07,49.78 | OK14.4 18.88,33.62 R42.2
  Bottom 0.305: v68.07,49.78 67.56,49.78 66.34,48.56 56.58,48.56 46.06,38.05 40.84,38.05 39.41,36.63 39.4,36.63 34.67,31.9 20.42,31.9 OK14.4
INPUT-3  (via drill 0.3)
  Top 0.305: U1.5 70.18,53.93 69.85,53.59 69.85,53.09 69.09,52.32 C9.1 v68.07,52.32 | OK15.4 11.77,33.62 R43.2
  Bottom 0.305: OK15.4 14.22,33.53 15.49,32.26 15.52,32.26 16.33,31.45 34.86,31.45 39.59,36.17 39.6,36.17 41.02,37.59 46.25,37.59 56.77,48.11 66.65,48.11 67.56,49.02 68.33,49.02 68.83,49.53 68.83,51.56 v68.07,52.32
INPUT-4  (via drill 0.3)
  Top 0.305: OK16.4 4.66,33.62 R44.2 | U1.4 70.02,55.2 C11.1
  Bottom 0.305: OK16.4 7.11,33.53 9.65,30.99 36.32,30.99 37.95,32.61 37.95,33.22 41.4,36.68 46.63,36.68 57.15,47.19 68.02,47.19 69.34,48.51 69.34,52.67 C11.1
  other vias: 68.41,53.59
IO0
  Top 0.305: 92.63,48.43 T12.C | U1.25 90.5,42.5 91.95,43.94 91.95,46.99 92.2,47.24 92.2,48.34 T12.C | T12.C 92.46,48.94 R10.1 92.84,51.09 R48.2
IO2-LED  (via drill 0.3)
  Top 0.305: U1.24 87.26,41.01 v87.88,40.39 | R5.2 v90.93,50.04 R4.1
  Bottom 0.305: v87.88,40.39 88.14,40.64 88.14,47.24 88.14,49.53 88.65,50.04 v90.93,50.04
IO4  (via drill 0.3)
  Top 0.305: U1.26 86.35,43.77 85.91,43.33 83.46,43.33 83.06,42.93 v79.76,42.93
  Bottom 0.305: v79.76,42.93 80.01,42.67 80.01,39.6 78.25,37.85 76.2,37.85 74.93,36.58 JP4.2
IO5  (via drill 0.3)
  Top 0.305: U1.29 88.22,47.58 85.34,44.7 v80.01,44.7
  Bottom 0.305: v80.01,44.7 80.52,44.2 80.52,39.37 78.49,37.34 78.49,35.81 77.98,35.31 75.69,35.31 JP4.3
IRC
  Top 0.305: U1.16 75.69,40.88 75.69,35.81 76.96,34.54 IC3.1
N$1
  Top 0.305: OK7.1 57.4,30.65 R50.1
N$2
  Top 0.305: OK8.1 80.61,26.67 R63.1
N$3
  Top 0.305: R66.1 88.99,27.27 OK9.1
N$4
  Top 0.305: R69.1 95,28.7 97.03,26.67 OK10.1
N$5
  Top 0.61: R12.2 3.05,11.18 T1.G 3.05,16 4.06,17.02 4.06,19.3 3.05,20.32 OK1.4
N$6
  Bottom 0.61: OK1.6 10.16,23.37 R15.2
N$7
  Top 0.254: T11.B 94.83,39.87 R1.1
N$8
  Top 0.305: T12.B 94.83,46.48 R3.1
N$9
  Top 0.305: 89.58,55.2 U1.35 90.67,55.2 R49.1
N$10  (via drill 0.5)
  Top 0.406: USB.1 93.44,31.21 v93.22,30.99 | 82.04,36.07 U2.16 82.04,36.07 | C22.1 82.04,37.5 82.04,36.07 | 80.26,35.03 C24.+ | 82.04,36.07 80.43,36.07 D1.A
  Top 0.61: v92.71,33.78 85.72,33.78 84.73,34.77 C24.+ 80.26,35.03 D1.A
  Bottom 0.61: v92.71,33.78 92.71,31.5 v93.22,30.99
N$11
  Top 0.305: USB.2 91.58,31.86 91.19,32.26 89.15,32.26 88.52,31.62 U2.6
N$12
  Top 0.305: USB.3 91.69,32.51 91.44,32.77 88.65,32.77 87.25,31.37 U2.5
N$13
  Bottom 0.61: T5.A1 49.78,12.95 49.78,14.99 R36.1
  Bottom 1.016: OUTS1-5.6 44.02,8.38 47.24,8.38 48.01,9.14 T5.A1
N$14
  Bottom 0.61: OK2.4 R8.2 15.24,16.26 17.27,14.22 T2.G
N$15
  Bottom 0.61: OK2.6 18.03,17.27 18.03,16 R9.2
N$16
  Bottom 0.61: R19.1 71.37,14.99 71.37,12.95 T6.A1
  Bottom 1.016: T6.A1 69.6,9.14 70.61,8.13 70.61,3.83 OUTS6-10.3
N$17
  Bottom 0.61: T7.A1 57.91,15.75 55.37,18.29 C2.2
  Bottom 1.27: T7.A1 R51.1 60.71,6.86 64.26,6.86 65.63,5.49 OUTS6-10.2
N$18
  Bottom 0.61: OK6.4 R19.2 67.06,14.22 T6.G
N$19
  Bottom 0.61: OK6.6 67.82,17.27 67.82,16 R21.2
N$21
  Bottom 0.61: OK3.4 R18.2 26.67,14.22 T3.G
N$22
  Bottom 0.61: R64.1 80.77,14.99 80.77,12.95 T8.A1
  Bottom 1.016: OUTS6-10.4 75.67,6.07 78.99,9.4 T8.A1
N$23
  Bottom 0.61: OK3.6 27.43,17.27 27.43,16 28.7,14.73 R20.2
N$24
  Bottom 0.61: R67.1 90.17,14.99 90.17,12.95 T9.A1
  Bottom 1.016: OUTS6-10.5 80.67,6.5 82.3,8.13 86.61,8.13 88.39,9.91 T9.A1
N$25
  Top 0.61: R70.1 96.01,14.99 96.01,13.72 97.79,11.94 T10.A1
  Bottom 1.016: OUTS6-10.6 89.99,8.13 91.44,8.13 96.27,8.13 97.79,9.65 T10.A1
N$26
  Top 0.61: C10.1 41.01,37.9 IC1.3
  Top 1.016: B2.+ 55.63,45.47 55.12,45.97 C12.+ 48.77,45.97 42.42,39.62 42.42,38.1 42.39,38.08 IC1.3
N$27
  Top 0.305: R90.2 LD6.A
N$28  (via drill 0.3)
  Top 0.305: LD7.A v90.93,56.41
  Bottom 0.305: v90.93,56.41 90.93,54.45 91.28,54.1 91.28,53.6 90.93,53.24 R4.2
  other vias: 90.93,52.41
N$29
  Top 0.61: R51.2 T7.G 52.83,16.51 53.59,17.27 53.59,18.8 52.32,20.07 52.32,20.57 OK7.4
N$30
  Bottom 0.61: OK7.6 59.69,21.34 R62.2
N$31
  Bottom 0.61: T4.G 36.07,14.22 R25.2 OK4.4
N$32
  Bottom 0.61: OK4.6 37.08,17.53 37.08,15.75 R26.2
N$33
  Top 0.254: OK1.1 R2.1
N$34
  Top 0.508: R11.1 30.92,48.51 R13.2
N$35
  Bottom 0.61: OK5.4 R36.2 45.47,14.22 T5.G
N$36
  Bottom 0.61: OK5.6 46.48,17.53 46.48,15.75 R37.2
N$37
  Top 0.508: R14.2 29.02,49.28 R13.1
N$38
  Bottom 0.508: R23.2 35.05,47.82 R22.1
N$39
  Bottom 0.508: R23.1 33.4,51.24 R27.2
N$40
  Top 0.305: R48.1 C4.2 97.17,52.79 BOOT.1 BOOT.2
N$41
  Top 1.016: POWER.1 53.09,56.36 53.09,53.59 53.59,53.09 56.13,53.09 56.9,52.32 56.9,51.05 57.34,50.61 B2.AC1
N$42
  Top 0.254: OK2.1 19.72,26.76 R7.1
N$43
  Top 0.254: OK3.1 29.12,26.76 R17.1
N$44
  Top 0.254: OK4.1 38.61,28.36 R24.1
N$45
  Bottom 0.61: OK8.4 R64.2 76.45,14.22 T8.G
N$46
  Bottom 0.61: OK8.6 77.22,17.27 77.22,16 R65.2
N$47
  Bottom 0.61: OK9.4 R67.2 85.85,14.22 T9.G
N$48
  Top 0.305: Q1.B 38.28,41.05 D4.C D5.A
  Top 0.508: R55.2 40.57,48.51 B1.+ 38.28,47.61 D5.A
N$49
  Top 0.305: Q1.C 34.71,41.15 OK12.1
N$50
  Bottom 0.61: R68.2 86.61,16 86.61,17.27 OK9.6
N$51
  Bottom 0.61: OK10.4 R70.2 95.25,14.22 T10.G
N$52
  Bottom 0.61: OK10.6 96.01,17.27 96.01,16 R71.2
N$53
  Top 0.254: OK5.1 47.41,27.27 R34.1
N$54
  Top 0.305: R16.1 68.49,27.77 OK6.1
N$55
  Top 1.016: POWER.2 48.03,53.57 50.04,51.56 55.37,51.56 55.63,51.31 B2.AC2 | B2.AC2 55.63,50.29 B2.AC2
N$56
  Top 0.508: OK13.1 LD1.C
N$57
  Top 0.508: OK13.2 R30.2
N$58
  Top 0.305: R56.1 33.72,42.16 36.85,42.16 Q1.E
N$59  (via drill 0.3)
  Top 0.508: v26.92,43.94 26.13,44.74 LD1.A
  Bottom 0.508: R74.2 26.35,43.94 v26.92,43.94
N$60
  Top 0.305: R56.2 32.45,45.33 C21.1 34.37,45.47 D5.C
N$61
  Top 0.508: OK14.2 R33.2
N$62
  Bottom 0.61: INPUTS.2 28.96,53.95 28.96,52.07 29.97,51.05 R27.1
N$63  (via drill 0.3)
  Top 0.508: B1.AC2 33.47,47.94 v33.27,47.75
  Bottom 0.508: v33.27,47.75 R22.2
N$64
  Top 0.508: OK14.1 LD2.C
N$65  (via drill 0.3)
  Top 0.305: v34.29,43.69 D4.A | v31.24,45.47 C21.2
  Top 0.508: B1.- 40.57,51.05 R55.1 41.98,50.73 42.42,50.29 42.42,45.72 40.39,43.69 v39.88,43.69
  Bottom 0.61: v39.88,43.69 v34.29,43.69 31.24,43.69 | 31.24,43.69 30.73,43.69 30.48,43.43 OK12.2 | v31.24,45.47 31.24,43.69
N$66
  Top 0.508: R38.2 OK15.2
N$67  (via drill 0.3)
  Top 0.508: v19.81,44.2 19.27,44.74 LD2.A
  Bottom 0.508: R78.2 v19.81,44.2
N$68
  Top 0.508: R40.2 OK16.2
N$69
  Bottom 0.508: 24.13,48.33 R29.1
  Bottom 0.61: INPUTS.3 26.39,54.08 24.13,51.82 24.13,48.33 R29.1
N$70
  Bottom 0.61: INPUTS.4 21.36,54.38 17.02,50.04 17.02,48.33 R31.1
N$71
  Bottom 0.61: INPUTS.5 16.36,53.44 13.72,50.8 11.18,50.8 10.41,50.04 10.41,48.01 10.41,48.19 R35.1
N$72
  Top 0.508: R88.1 R84.1 R80.1 R76.1 28.19,50.48 R14.1 30.29,52.58 34.54,52.58 36.4,54.43 INPUTS.1
N$73
  Bottom 0.508: 3.05,48.26 R39.1
  Bottom 0.61: INPUTS.6 6.27,51.31 4.06,51.31 3.05,50.29 3.05,48.01 3.11,48.07 R39.1
N$74  (via drill 0.35)
  Top 0.305: v83.19,30.48 U2.2
  Bottom 0.305: R91.1 83.15,30.48 v83.19,30.48
N$75
  Top 0.508: OK15.1 LD3.C
N$76  (via drill 0.3)
  Top 0.508: v13.21,44.2 12.67,44.74 LD3.A
  Bottom 0.508: R82.2 v13.21,44.2
N$77
  Top 0.508: LD4.C OK16.1
N$78  (via drill 0.3)
  Top 0.508: v5.84,44.2 5.3,44.74 LD4.A
  Bottom 0.508: R86.2 v5.84,44.2
N$79
  Top 0.61: R45.2 LD5.A
N$80
  Bottom 0.61: C1.1 R15.1 R46.2
N$81
  Bottom 0.61: R47.1 R62.1 C2.1
N$82
  Top 0.305: 97.37,39.5 RST.1 97.37,43.78 97.41,43.81 97.03,44.2 95.08,44.2 R28.1 | 97.37,39.5 RST.2 | C5.2 97.28,39.59 97.37,39.5
N$83
  Top 0.305: IC4.1 62.74,32.11 R60.1
N$84
  Top 0.508: R11.2 31.94,51.05 B1.AC1
N$85
  Top 0.305: JP1.2 67.06,31.24 66.55,31.75 66.67,31.88 IC4.4
N$86
  Top 0.305: IC4.3 65.41,30.1 JP2.2
N$87
  Top 0.305: J1.2 60.45,54.86 61.21,54.1 62.48,54.1 63.08,53.51 R54.1
N$88  (via drill 0.35)
  Top 0.305: U2.3 v84.58,30.6 v84.58,30.61
  Bottom 0.305: v84.58,30.61 84.58,30.52 R92.1
N$89
  Top 0.406: U2.4 85.98,29 C23.2
N$90
  Bottom 0.508: R29.2 R73.1
N$91
  Bottom 0.508: R73.2 R74.1
N$92
  Top 0.508: R30.1 R75.2
N$93
  Top 0.508: R75.1 25.79,48.7 R76.2
N$94
  Bottom 0.508: R77.1 R31.2
N$95
  Bottom 0.508: R77.2 R78.1
N$96
  Top 0.508: R33.1 R79.2
N$97
  Top 0.508: R79.1 18.67,48.7 R80.2
N$98
  Bottom 0.508: R35.2 R81.1
N$99
  Bottom 0.508: R81.2 R82.1
N$100
  Top 0.508: R83.2 R38.1
N$101
  Top 0.508: R83.1 11.56,48.7 R84.2
N$102
  Bottom 0.508: R39.2 R85.1
N$103
  Bottom 0.508: R85.2 R86.1
N$104
  Top 0.508: R87.2 R40.1
N$105
  Top 0.508: R88.2 2.15,48.58 R87.1
N$108
  Bottom 0.61: C1.2 5.84,18.29 8.13,16 T1.A1
  Bottom 1.27: T1.A1 8.13,11.18 R12.1 9.4,7.87 10.41,6.86 17.53,6.86 19.41,4.98 OUTS1-5.2
N$109
  Bottom 0.61: T2.A1 21.59,12.95 21.59,14.99 R8.1
  Bottom 1.016: T2.A1 19.81,8.41 OUTS1-5.3
N$1010
  Bottom 0.61: R18.1 30.99,14.99 30.99,13.46 29.21,11.68 T3.A1
  Bottom 1.016: T3.A1 29.21,4.04 OUTS1-5.4
N$1015
  Bottom 0.61: T4.A1 40.39,12.95 40.39,14.99 R25.1
  Bottom 1.016: T4.A1 38.61,9.65 36.58,7.62 35.05,7.62 34.44,7.01 OUTS1-5.5
OUT1  (via drill 0.3)
  Top 0.305: v71.88,47.5 71.09,47.5 U1.10
  Bottom 0.305: v71.88,47.5 71.88,43.3 71.67,43.08 69.89,43.08 66.08,39.27 64.52,39.27 56.8,31.55 50.98,31.55 48.7,29.26 23.52,29.26 22.35,28.09 21.43,28.09 20.57,28.96 R2.2
  other vias: 12.53,28.96
OUT2  (via drill 0.3)
  Top 0.305: v22.1,28.7 R7.2 | v71.12,43.69 70.87,43.94 70.87,43.91 U1.13
  Bottom 0.305: v22.1,28.7 23.12,29.72 48.51,29.72 50.8,32 56.61,32 62.85,38.24 64.33,39.73 65.89,39.73 69.85,43.69 v71.12,43.69
OUT3  (via drill 0.3)
  Top 0.305: U1.11 72.06,46.31 72.64,45.72 v72.64,44.2 | R17.2 31.24,28.28 v31.24,27.94
  Bottom 0.305: v72.64,44.2 72.64,43.18 72.08,42.62 70.08,42.62 66.27,38.81 64.71,38.81 56.99,31.09 51.17,31.09 48.89,28.8 32.11,28.8 v31.24,27.94
OUT4  (via drill 0.3)
  Top 0.305: U1.30 88.93,48.77 87.88,48.77 87.73,48.62 87.73,47.74 85.31,45.31 79.76,45.31 78.24,43.79 74.32,43.79 v73.91,44.2 | v40.89,27.69 40.13,28.45 R24.2
  Bottom 0.305: v73.91,44.2 73.91,43.6 72.48,42.16 70.27,42.16 66.46,38.35 64.9,38.35 57.18,30.63 51.36,30.63 49.08,28.35 41.55,28.35 v40.89,27.69
OUT5  (via drill 0.3)
  Top 0.305: R34.2 v50.29,28.7 | U1.31 88.47,50.12 87.27,48.92 87.27,47.93 85.11,45.77 79.57,45.77 78.05,44.25 74.88,44.25 v74.68,44.45
  Bottom 0.305: v74.68,44.45 74.68,43.46 72.93,41.71 70.45,41.71 66.64,37.9 65.09,37.9 57.37,30.18 51.77,30.18 v50.29,28.7
OUT6  (via drill 0.3, 0.35)
  Top 0.305: R50.2 v59.44,30.73 | 71.17,42.34 U1.14 70.93,42.42 70.87,42.42 70.61,42.16 v70.61,40.57
  Bottom 0.305: v59.44,30.73 59.44,31.5 65.38,37.44 66.14,37.44 66.83,37.44 69.88,40.49 70.53,40.49 v70.61,40.57
OUT7
  Top 0.305: U1.23 84.45,41.43 83.57,42.32 73.97,42.32 72.29,40.63 72.29,36.03 73.15,35.17 73.15,30.06 R89.1 71.54,28.45 R16.2
OUT8  (via drill 0.3)
  Top 0.305: U1.36 88.93,56.39 v87.88,56.39 | 81.03,28.61 80.94,28.53 81.03,28.61 | v81.03,29.97 R63.2 81.03,28.61
  Bottom 0.305: v87.88,56.39 85.7,54.2 85.7,42.76 82.7,39.76 82.7,33.94 81.03,32.26 v81.03,29.97
OUT9  (via drill 0.3, 0.35)
  Top 0.305: R66.2 86.61,29.38 86.61,31.24 v85.85,32 | v87.48,52.99 87.12,53.34 87.12,53.59 87.12,57.15 87.71,57.74 U1.37
  Bottom 0.305: v87.48,52.99 87.48,52.93 87.12,52.58 87.12,41.53 84.2,38.61 84.2,34.29 85.85,32.64 v85.85,32
OUT10  (via drill 0.3)
  Top 0.305: U1.33 88.22,52.66 v88.14,52.58 | R69.2 90.59,29.61 90.45,29.75 90.45,31.47 v90.42,31.5
  Bottom 0.305: v88.14,52.58 87.63,52.07 87.63,41.27 84.71,38.35 84.71,34.43 87.64,31.5 v90.42,31.5
PIR1  (via drill 0.3)
  Top 0.305: R57.2 R54.2 R58.1 61.38,49.87 v61.47,49.78 | U1.8 70.44,50.12 v70.36,50.04 | v69.6,47.75 69.34,47.5 69.34,39.12 70.87,37.59 70.87,35.31 70.87,35.05 71.37,34.54 v71.37,33.27
  Bottom 0.305: 67.81,53.85 68.16,54.2 68.99,54.2 70.36,52.83 v70.36,50.04 70.36,48.51 v69.6,47.75 | 67.81,53.85 67.81,53.84 | 67.81,53.85 67.81,53.08 67.31,52.58 67.31,51.05 65.79,49.53 61.72,49.53 v61.47,49.78 | v71.37,33.27 73.41,33.27 73.91,32.77 75.69,32.77 JP6.2
R/W  (via drill 0.3)
  Top 0.305: 64.14,33.66 IC4.2 64.14,30.35 JP2.1 | 64.14,33.66 64.52,34.04 v67.31,34.04 | JP6.1 75.69,30.23 75.69,34.8 75.18,35.31 73.66,35.31 72.9,36.07 v72.9,38.61 | U1.12 70.18,45.04 69.85,44.7 69.85,39.62 v70.61,38.86 | R52.2 61.68,33.66 64.14,33.66
  Bottom 0.305: v72.9,38.61 72.14,38.61 70.61,38.61 | 70.61,38.61 70.1,38.61 69.85,38.61 67.31,36.07 v67.31,34.04 | v70.61,38.86 70.61,38.61
RTS
  Top 0.254: T11.E 94.76,43.18
  Top 0.305: 94.76,43.18 T11.E 94.76,43.18 | R3.2 93.22,46.23 93.73,45.72 93.73,43.18 | U2.14 84.71,35.79 86.11,34.39 92.05,34.39 93.73,36.07 93.73,43.18 | 94.76,43.18 93.73,43.18
RX  (via drill 0.3)
  Top 0.305: DEBUG.3 85.72,38.99 83.82,38.99 83.44,39.37 v83.31,39.37 | U1.34 88.31,53.93 v87.88,54.36
  Bottom 0.305: v87.88,54.36 87.24,54.36 86.16,53.27 86.16,42.57 83.31,39.72 v83.31,39.37 83.19,39.24 83.19,33.24 83.06,33.12 R91.2
RX-2  (via drill 0.3)
  Top 0.305: R61.2 61.98,28.61 R60.2 66.71,28.61 67.56,29.46 71.74,29.46 72.69,30.41 72.69,30.73 | U1.27 86.97,45.04 85.72,43.79 83.06,43.79 82.81,43.53 79.5,43.53 78.85,42.88 73.89,42.88 71.83,40.82 71.83,35.59 72.69,34.72 72.69,30.73 | v72.39,30.73 72.69,30.73
  Bottom 0.305: JP5.1 74.42,29.72 73.41,30.73 v72.39,30.73
TX  (via drill 0.3)
  Top 0.305: DEBUG.2 88.9,38.1 87.38,39.62 v84.07,39.62 | R49.2 90.84,53.85 v90.42,53.85
  Bottom 0.305: v90.42,53.85 88.39,53.85 88.14,53.59 87.12,53.59 86.61,53.09 86.61,42.16 v84.07,39.62 84.07,39.24 83.69,38.86 83.69,34.04 84.71,33.02 R92.2
TX-2  (via drill 0.3)
  Top 0.305: JP2.3 66.8,30.23 JP1.1 70.45,30.23 R72.2 72.24,32.02 72.24,32.51 | 72.24,32.51 v71.88,32.51 | U1.28 87.59,46.31 85.53,44.25 82.87,44.25 82.62,43.99 79.31,43.99 78.66,43.33 73.69,43.33 71.38,41.02 71.38,35.4 72.24,34.53 72.24,32.51
  Bottom 0.305: JP5.2 73.41,32.51 v71.88,32.51

### Text on the board
tPlace: PIR | RS485 | INPUT 4 | INPUT 3 | INPUT 2 | INPUT 1 | AC WIFI DIMMER V1.0 | FA | O1 | O2 | O3 | O4 | O5 | FA | O1 | O2 | O3 | O4 | O5 | C | L | 2019
bPlace: IN4 | IN3 | IN2 | IN1 | FASE | NEUTRO | PIR SENSOR | GND | PIR | +5V | POWER IN / AC 6-15V | HIGH VOLTAGE! | RS-485 | GND | D+ | D- | AC DIMMER / 10 CH | EXPAN | DEBUG | +5V | +3V3 | HIGH VOLTAGE! | C | IO4 | GND | <<RX | GND | 2019 | L | IO5 | IRC | TX-2>> | PIR | RX-2<< | R/W | HIGH VOLTAGE! | HIGH VOLTAGE! | FASE | OUT1 | OUT2 | OUT3 | OUT4 | OUT5 | FASE | OUT6 | OUT7 | OUT8 | OUT9 | OUT10
201bmp: INPUT 1 | INPUT 2 | INPUT 3 | INPUT 4